# Altium schematic sheet [4] Sensor Boards.SchDoc
size A4
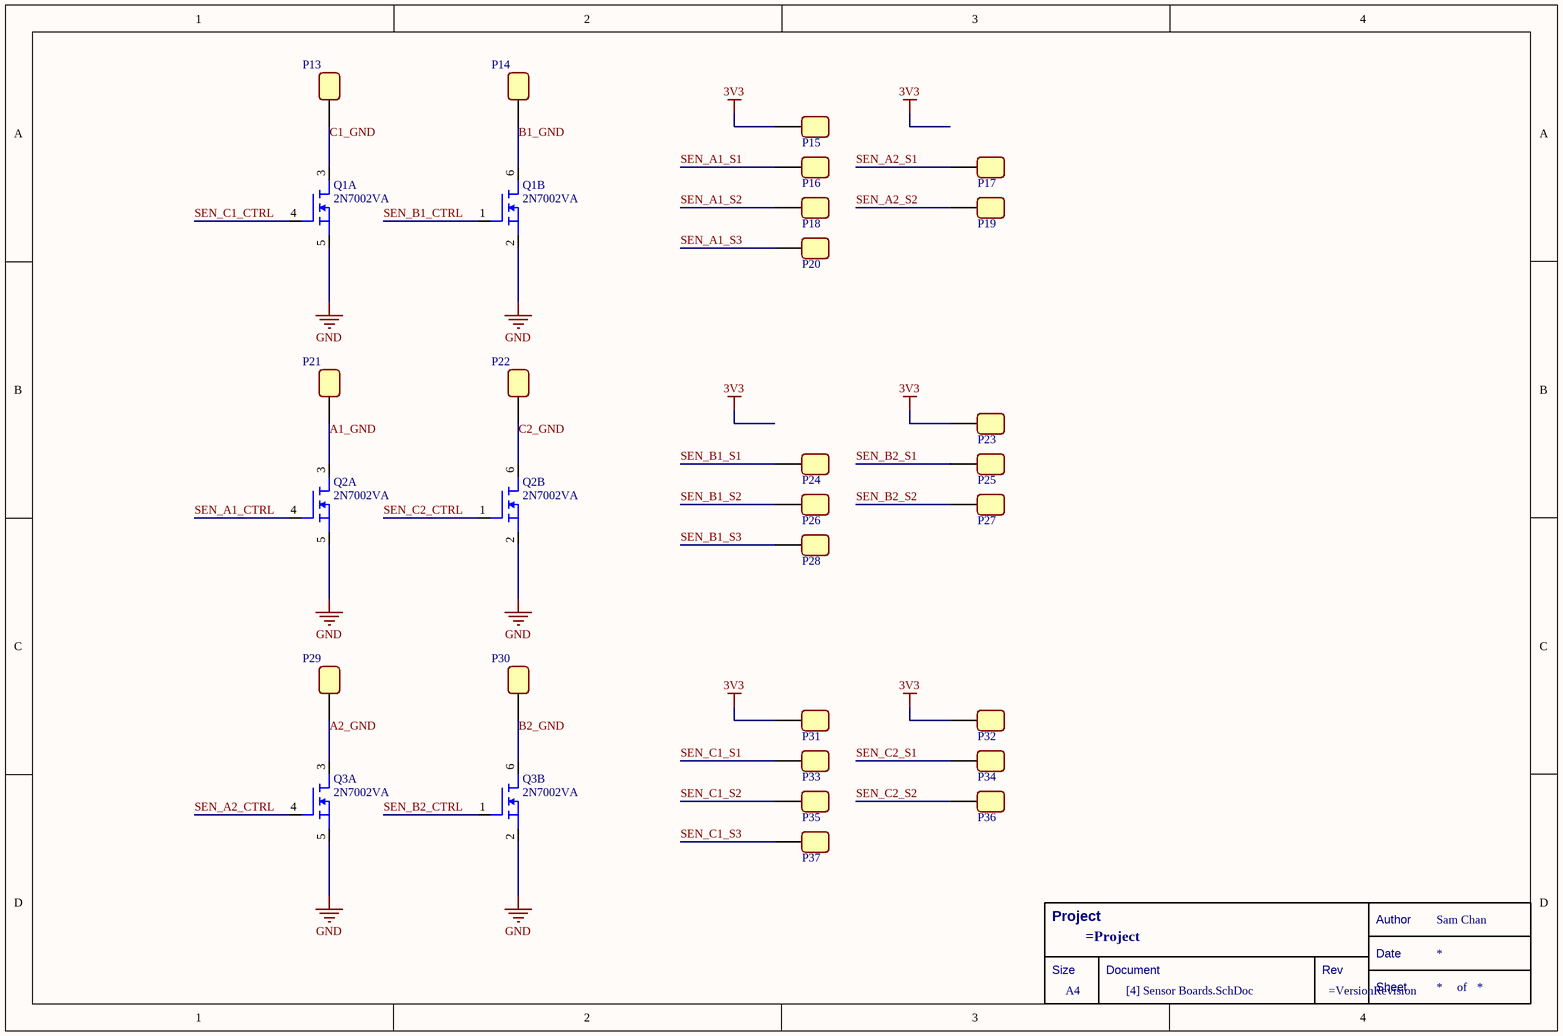
[diagram p0: [4] Sensor Boards.SchDoc]

## Parts
*  Title Block  (value not drawn)  (graphical)
P13  PAD_4  [PAD_0.5X1MM]  (value not drawn)  (no BOM)
P14  PAD_4  [PAD_0.5X1MM]  (value not drawn)  (no BOM)
P15  PAD_4  [PAD_0.5X1MM]  (value not drawn)  (no BOM)
P16  PAD_4  [PAD_0.5X1MM]  (value not drawn)  (no BOM)
P17  PAD_4  [PAD_0.5X1MM]  (value not drawn)  (no BOM)
P18  PAD_4  [PAD_0.5X1MM]  (value not drawn)  (no BOM)
P19  PAD_4  [PAD_0.5X1MM]  (value not drawn)  (no BOM)
P20  PAD_4  [PAD_0.5X1MM]  (value not drawn)  (no BOM)
P21  PAD_4  [PAD_0.5X1MM]  (value not drawn)  (no BOM)
P22  PAD_4  [PAD_0.5X1MM]  (value not drawn)  (no BOM)
P23  PAD_4  [PAD_0.5X1MM]  (value not drawn)  (no BOM)
P24  PAD_4  [PAD_0.5X1MM]  (value not drawn)  (no BOM)
P25  PAD_4  [PAD_0.5X1MM]  (value not drawn)  (no BOM)
P26  PAD_4  [PAD_0.5X1MM]  (value not drawn)  (no BOM)
P27  PAD_4  [PAD_0.5X1MM]  (value not drawn)  (no BOM)
P28  PAD_4  [PAD_0.5X1MM]  (value not drawn)  (no BOM)
P29  PAD_4  [PAD_0.5X1MM]  (value not drawn)  (no BOM)
P30  PAD_4  [PAD_0.5X1MM]  (value not drawn)  (no BOM)
P31  PAD_4  [PAD_0.5X1MM]  (value not drawn)  (no BOM)
P32  PAD_4  [PAD_0.5X1MM]  (value not drawn)  (no BOM)
P33  PAD_4  [PAD_0.5X1MM]  (value not drawn)  (no BOM)
P34  PAD_4  [PAD_0.5X1MM]  (value not drawn)  (no BOM)
P35  PAD_4  [PAD_0.5X1MM]  (value not drawn)  (no BOM)
P36  PAD_4  [PAD_0.5X1MM]  (value not drawn)  (no BOM)
P37  PAD_4  [PAD_0.5X1MM]  (value not drawn)  (no BOM)
Q1  2N7002VA  [2N7002VA]  (parts A,B of 2)
Q2  2N7002VA  [2N7002VA]  (parts A,B of 2)
Q3  2N7002VA  [2N7002VA]  (parts A,B of 2)

## Nets
3V3: P15.1 P23.1 P31.1 P32.1
GND: Q1.2(S2) Q1.5(S1) Q2.2(S2) Q2.5(S1) Q3.2(S2) Q3.5(S1)
A1_GND: P21.1 Q2.3(D1)
A2_GND: P29.1 Q3.3(D1)
B1_GND: P14.1 Q1.6(D2)
B2_GND: P30.1 Q3.6(D2)
C1_GND: P13.1 Q1.3(D1)
C2_GND: P22.1 Q2.6(D2)
SEN_A1_CTRL: Q2.4(G1)
SEN_A1_S1: P16.1
SEN_A1_S2: P18.1
SEN_A1_S3: P20.1
SEN_A2_CTRL: Q3.4(G1)
SEN_A2_S1: P17.1
SEN_A2_S2: P19.1
SEN_B1_CTRL: Q1.1(G2)
SEN_B1_S1: P24.1
SEN_B1_S2: P26.1
SEN_B1_S3: P28.1
SEN_B2_CTRL: Q3.1(G2)
SEN_B2_S1: P25.1
SEN_B2_S2: P27.1
SEN_C1_CTRL: Q1.4(G1)
SEN_C1_S1: P33.1
SEN_C1_S2: P35.1
SEN_C1_S3: P37.1
SEN_C2_CTRL: Q2.1(G2)
SEN_C2_S1: P34.1
SEN_C2_S2: P36.1

## Notes on the sheet
- (in symbol Title Block) Project; Author; Sam Chan; Date; Size; Document; Rev; A4; Sheet; of

## Library data of the parts
* = Title Block: Standard Title Block
P13-P37 = PAD_4: a Rec pad, 0.5X1mm
Q1-Q3 = 2N7002VA: Mosfet Array 2 N-Channel (Dual) 60V 280mA 150mW Surface Mount SOT-563; Manufacturer: Diodes Incorporated; Manufacturer Part Number: 2N7002VA-7-F; Categories: Transistors; Case: SOT-563; Notes: -